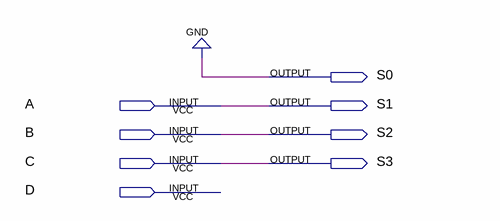
[diagram p0: schematic sheet]
// Quartus schematic Divide2.bdf as structural Verilog: 0 symbols, 8 pins
module Divide2 (
  input  A,
  input  B,
  input  C,
  input  D,
  output S0,
  output S1,
  output S2,
  output S3
);


  assign S0 = 1'b0;
  assign S1 = A;
  assign S2 = B;
  assign S3 = C;
endmodule
